# EAGLE schematic untitled (EAGLE 9.6.1)
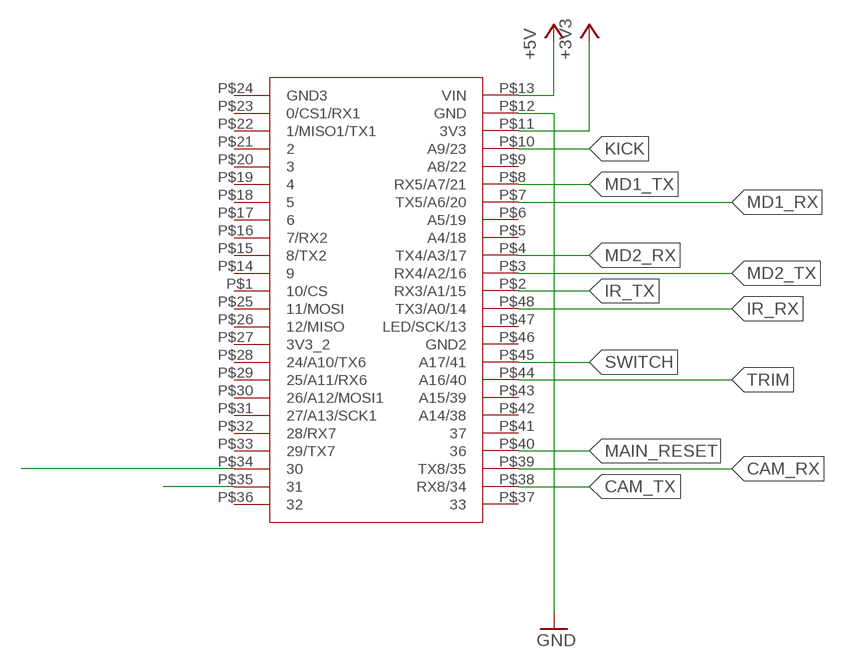
[diagram p0: schematic, sheet 1]

## Parts
U$1  TEENSY4.1  [TEENSY4.1]

## Nets
+3V3: U$1.P$11(3V3)
+5V: U$1.P$13(VIN)
CAM_RX: U$1.P$39(TX8/35)
CAM_TX: U$1.P$38(RX8/34)
GND: U$1.P$12(GND)
IR_RX: U$1.P$48(TX3/A0/14)
IR_TX: U$1.P$2(RX3/A1/15)
KICK: U$1.P$10(A9/23)
MAIN_RESET: U$1.P$40
MD1_RX: U$1.P$7(TX5/A6/20)
MD1_TX: U$1.P$8(RX5/A7/21)
MD2_RX: U$1.P$4(TX4/A3/17)
MD2_TX: U$1.P$3(RX4/A2/16)
N$1: U$1.P$35
N$2: U$1.P$34
SWITCH: U$1.P$45(A17/41)
TRIM: U$1.P$44(A16/40)
Unconnected: U$1.P$1(10/CS) U$1.P$5(A4/18) U$1.P$6(A5/19) U$1.P$9(A8/22) U$1.P$14 U$1.P$15(8/TX2) U$1.P$16(7/RX2) U$1.P$17 U$1.P$18 U$1.P$19 U$1.P$20 U$1.P$21 U$1.P$22(1/MISO1/TX1) U$1.P$23(0/CS1/RX1) U$1.P$24(GND3) U$1.P$25(11/MOSI) U$1.P$26(12/MISO) U$1.P$27(3V3_2) U$1.P$28(24/A10/TX6) U$1.P$29(25/A11/RX6) U$1.P$30(26/A12/MOSI1) U$1.P$31(27/A13/SCK1) U$1.P$32(28/RX7) U$1.P$33(29/TX7) U$1.P$36 U$1.P$37 U$1.P$41 U$1.P$42(A14/38) U$1.P$43(A15/39) U$1.P$46(GND2) U$1.P$47(LED/SCK/13)

## Library data of the parts
U$1 = Teensy4.0:TEENSY4.1